# Altium schematic sheet arduino_connections.SchDoc: Arduino Connections
size A4; Date: 2022-01-17; Author: Juan del Pino Mena; CompanyName: TCI; DrawnBy: Juan del Pino Mena; Engineer: Juan del Pino Mena; Organization: UGR; DocumentNumber: 1; Revision: 0.8; SheetNumber: 2; SheetTotal: 3
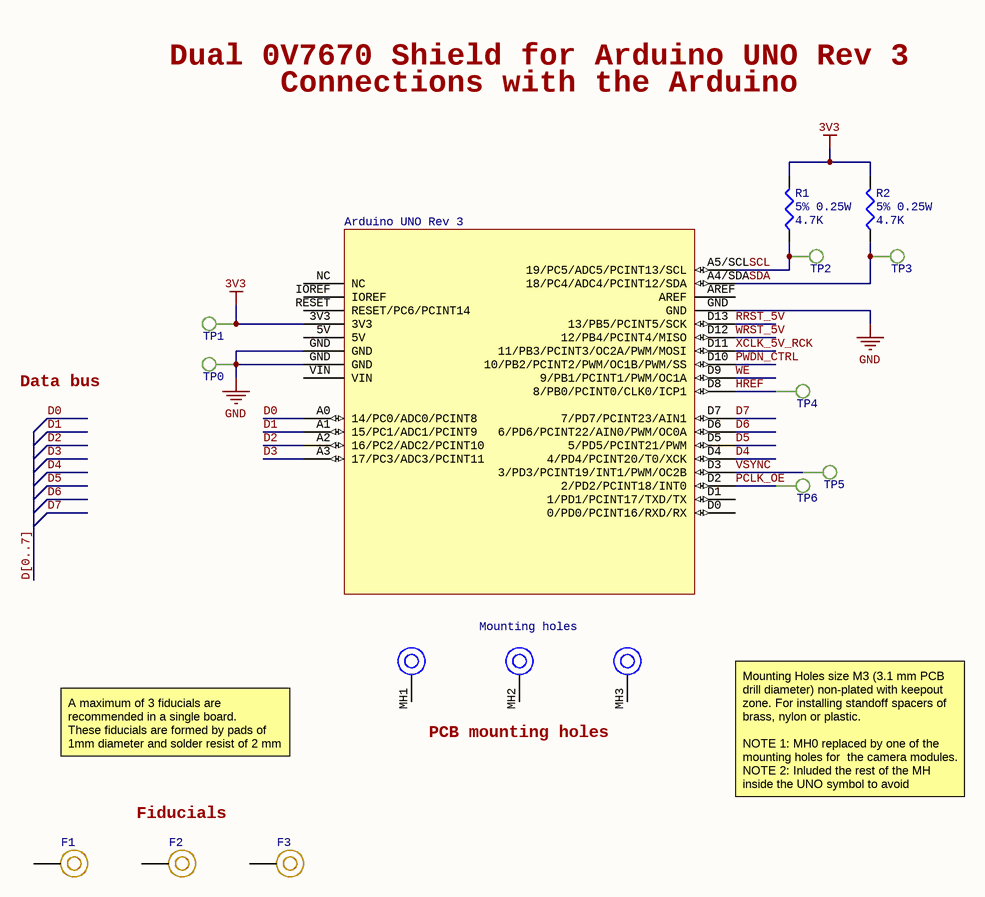
[diagram p0: arduino_connections.SchDoc]

## Parts
F1  Fiducial_1mm_2mm  [FIDUCIAL_1MM_2MM]  (value not drawn)
F2  Fiducial_1mm_2mm  [FIDUCIAL_1MM_2MM]  (value not drawn)
F3  Fiducial_1mm_2mm  [FIDUCIAL_1MM_2MM]  (value not drawn)
MCU1  Arduino UNO Rev 3  [Arduino UNO Rev 3]
R1  5% 0.25W  value 4.7K  [0603 RES]
R2  5% 0.25W  value 4.7K  [0603 RES]
TP0  Test Point Pad  [TEST POINT PAD]  (value not drawn)
TP1  Test Point Pad  [TEST POINT PAD]  (value not drawn)
TP2  Test Point Pad  [TEST POINT PAD]  (value not drawn)
TP3  Test Point Pad  [TEST POINT PAD]  (value not drawn)
TP4  Test Point Pad  [TEST POINT PAD]  (value not drawn)
TP5  Test Point Pad  [TEST POINT PAD]  (value not drawn)
TP6  Test Point Pad  [TEST POINT PAD]  (value not drawn)

## Nets
3V3: MCU1.3V3 R1.2 R2.2 TP1.1
GND: MCU1.GND TP0.1
D0: MCU1.A0(14/PC0/ADC0/PCINT8)
D1: MCU1.A1(15/PC1/ADC1/PCINT9)
D2: MCU1.A2(16/PC2/ADC2/PCINT10)
D3: MCU1.A3(17/PC3/ADC3/PCINT11)
D4: MCU1.D4(4/PD4/PCINT20/T0/XCK)
D5: MCU1.D5(5/PD5/PCINT21/PWM)
D6: MCU1.D6(6/PD6/PCINT22/AIN0/PWM/OC0A)
D7: MCU1.D7(7/PD7/PCINT23/AIN1)
HREF: MCU1.D8(8/PB0/PCINT0/CLK0/ICP1) TP4.1
PCLK_OE: MCU1.D2(2/PD2/PCINT18/INT0) TP6.1
PWDN_CTRL: MCU1.D10(10/PB2/PCINT2/PWM/OC1B/PWM/SS)
RRST_5V: MCU1.D13(13/PB5/PCINT5/SCK)
SCL: MCU1.A5/SCL(19/PC5/ADC5/PCINT13/SCL) R1.1 TP2.1
SDA: MCU1.A4/SDA(18/PC4/ADC4/PCINT12/SDA) R2.1 TP3.1
VSYNC: MCU1.D3(3/PD3/PCINT19/INT1/PWM/OC2B) TP5.1
WE: MCU1.D9(9/PB1/PCINT1/PWM/OC1A)
WRST_5V: MCU1.D12(12/PB4/PCINT4/MISO)
XCLK_5V_RCK: MCU1.D11(11/PB3/PCINT3/OC2A/PWM/MOSI)

Not connected (* = marked no-connect by the designer): F1 1; F2 1; F3 1; MCU1 5V AREF D0(0/PD0/PCINT16/RXD/RX) D1(1/PD1/PCINT17/TXD/TX) IOREF MH1 MH2 MH3 NC RESET(RESET/PC6/PCINT14) VIN

## Buses and harness runs
bus D[0..7]

## Notes on the sheet
- Dual 0V7670 Shield for Arduino UNO Rev 3
- Connections with the Arduino
- Data bus
- A maximum of 3 fiducials are recommended in a single board.
  These fiducials are formed by pads of 1mm diameter and solder resist of 2 mm diameter
- (near MCU1) PCB mounting holes
- (near F2) Fiducials
- (near MCU1) Mounting Holes size M3 (3.1 mm PCB drill diameter) non-plated with keepout zone. For installing standoff spacers of brass, nylon or plastic.
  NOTE 1: MH0 replaced by one of the mounting holes for  the camera modules.
  NOTE 2: Inluded the rest of the MH inside the UNO symbol to avoid collisions with spacers.
- Designer's signature
- Sheet title:
- Dpto. Electrónica y Tecnología
- de Computadores
- Supervisor's signature
- Project title:
- Desginer:
- University of Granada
- C/ Fuente Nueva, s/n, 18001
- Granada, Granada, Spain
- Sr. Andrés Roldán Aranda
- Date:
- Revision:
- Sheet
- of
- (in symbol Arduino UNO Rev 3) Mounting holes

## Library data of the parts
F1-F3 = Fiducial_1mm_2mm: Fiducial 1mm pad, 2mm solder resist
MCU1 = Arduino UNO Rev 3: Arduino UNO Rev 3 pinout
R1 R2 = Res4K7: SMD Resistor 4.7 KOhm 5% 0.1W 0603; Published: 8-Jun-2000; LatestRevisionDate: 29-May-2009; LatestRevisionNote: IPC-7351 Footprint Added.; PackageReference: J1-0603; Publisher: Altium Limited; PackageDescription: Chip Resistor
TP0-TP6 = Test Point Pad: Test point - PCB Pad type.